# Altium schematic sheet Decawave.SchDoc
size A
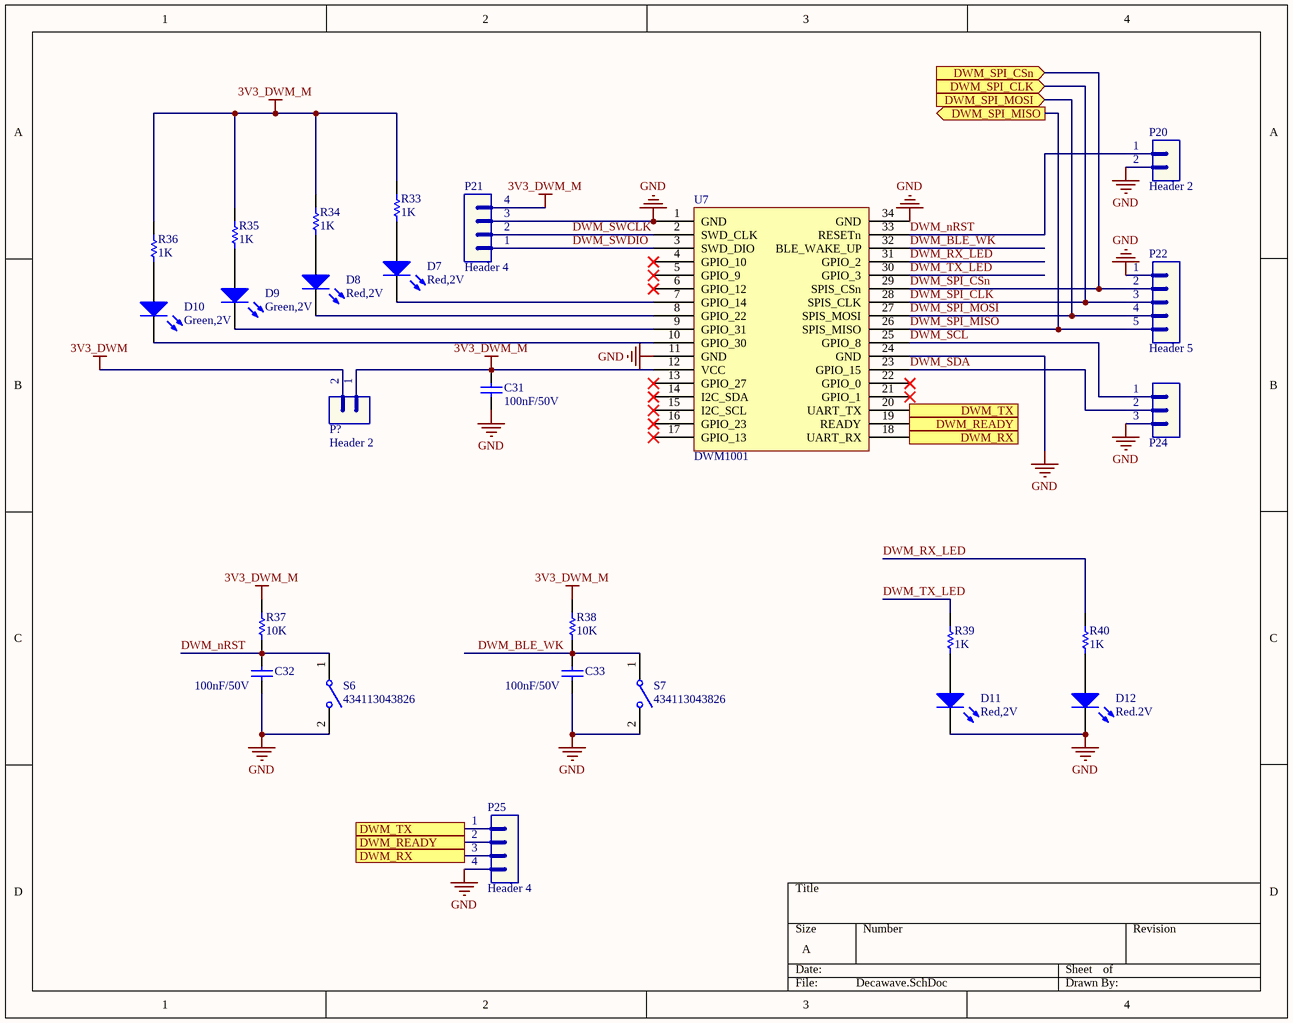
[diagram p0: Decawave.SchDoc]

## Parts
C31  value 100nF/50V  [CAP-SM-0805]  (hidden comment: Cap-100nF-50V-0805)
C32  value 100nF/50V  [CAP-SM-0805]  (hidden comment: Cap-100nF-50V-0805)
C33  value 100nF/50V  [CAP-SM-0805]  (hidden comment: Cap-100nF-50V-0805)
D7  value Red,2V  [LED-3mm]  (hidden comment: LED-RED-TH-3mm)
D8  value Red,2V  [LED-3mm]  (hidden comment: LED-RED-TH-3mm)
D9  value Green,2V  [LED-3mm]  (hidden comment: LED-GREEN-TH-3mm)
D10  value Green,2V  [LED-3mm]  (hidden comment: LED-GREEN-TH-3mm)
D11  value Red,2V  [LED-3mm]  (hidden comment: LED-RED-TH-3mm)
D12  value Red.2V  [LED-3mm]  (hidden comment: LED-RED-TH-3mm)
P20  Header 2  [JP2]
P21  Header 4  [JP4]
P22  Header 5  [JP5]
P24  Header 3  [JP3]  (value not drawn)
P25  Header 4  [JP4]
P?  Header 2  [JP2]
R33  value 1K  [RES-SM-0805]  (hidden comment: Res-1K-0805)
R34  value 1K  [RES-SM-0805]  (hidden comment: Res-1K-0805)
R35  value 1K  [RES-SM-0805]  (hidden comment: Res-1K-0805)
R36  value 1K  [RES-SM-0805]  (hidden comment: Res-1K-0805)
R37  value 10K  [RES-SM-0805]  (hidden comment: Res-10k-0805)
R38  value 10K  [RES-SM-0805]  (hidden comment: Res-10k-0805)
R39  value 1K  [RES-SM-0805]  (hidden comment: Res-1K-0805)
R40  value 1K  [RES-SM-0805]  (hidden comment: Res-1K-0805)
S6  434113043826  [434113043826]
S7  434113043826  [434113043826]
U7  DWM1001

## Ports
DWM_READY (in), DWM_READY (out), DWM_RX (in), DWM_RX (out), DWM_SPI_CLK (in), DWM_SPI_CSn (in), DWM_SPI_MISO (out), DWM_SPI_MOSI (in), DWM_TX (in), DWM_TX (out)

## Nets
3V3_DWM: P?.2
3V3_DWM_M: C31.2 P21.4 P?.1 R33.2 R34.2 R35.2 R36.2 R37.2 R38.2 U7.12(VCC)
GND: C31.1 C32.2 C33.2 D11.2(K) D12.2(K) P20.2 P21.3 P22.1 P24.3 P25.4 S6.2 S7.2 U7.1(GND) U7.11(GND) U7.24(GND) U7.34(GND)
DWM_BLE_WK: C33.1 R38.1 S7.1 U7.32(BLE_WAKE_UP)
DWM_nRST: C32.1 P20.1 R37.1 S6.1 U7.33(RESETn)
DWM_READY: P25.2 U7.19(READY) ; port DWM_READY
DWM_RX: P25.3 U7.18(UART_RX) ; port DWM_RX
DWM_RX_LED: R40.2 U7.31(GPIO_2)
DWM_SCL: P24.1 U7.25(GPIO_8)
DWM_SDA: P24.2 U7.23(GPIO_15)
DWM_SPI_CLK: P22.3 U7.28(SPIS_CLK) ; port DWM_SPI_CLK
DWM_SPI_CSn: P22.2 U7.29(SPIS_CSn) ; port DWM_SPI_CSn
DWM_SPI_MISO: P22.5 U7.26(SPIS_MISO) ; port DWM_SPI_MISO
DWM_SPI_MOSI: P22.4 U7.27(SPIS_MOSI) ; port DWM_SPI_MOSI
DWM_SWCLK: P21.2 U7.2(SWD_CLK)
DWM_SWDIO: P21.1 U7.3(SWD_DIO)
DWM_TX: P25.1 U7.20(UART_TX) ; port DWM_TX
DWM_TX_LED: R39.2 U7.30(GPIO_3)
NetD7_1: D7.1(A) R33.1
NetD7_2: D7.2(K) U7.7(GPIO_14)
NetD8_1: D8.1(A) R34.1
NetD8_2: D8.2(K) U7.8(GPIO_22)
NetD9_1: D9.1(A) R35.1
NetD9_2: D9.2(K) U7.9(GPIO_31)
NetD10_1: D10.1(A) R36.1
NetD10_2: D10.2(K) U7.10(GPIO_30)
NetD11_1: D11.1(A) R39.1
NetD12_1: D12.1(A) R40.1

Not connected (* = marked no-connect by the designer): U7 4(GPIO_10)* 5(GPIO_9)* 6(GPIO_12)* 13(GPIO_27)* 14(I2C_SDA)* 15(I2C_SCL)* 16(GPIO_23)* 17(GPIO_13)* 21(GPIO_1)* 22(GPIO_0)*

## Library data of the parts
C31-C33 = Cap-100nF-50V-0805: CAP CER 0.1UF 50V Y5V 0805; Manufacturer: Samsung Electro-Mechanics; Manufacturer Part Number: CL21F104ZBCNNNC; Local Supplier: thegioiic; Local Supplier Link: https://thegioiic.com/products/tu-100nf-0-1uf-50v-0805; Supplier 1: Digikey; Supplier 1 Part Number: 1276-1007-1-ND; Supplier 1 Link: https://www.digikey.com/product-detail/en/samsung-electro-mechanics/CL21F104ZBCNNNC/1276-1007-1-ND/3889093
D7 D8 D11 D12 = LED-RED-TH-3mm: LED RED CLEAR T-1 T/H; Manufacturer: Kingbright; Manufacturer Part Number: WP710A10SEC/J3; Local Supplier: thegioiic; Local Supplier Link: https://thegioiic.com/products/led-do-3mm-chan-dai; Supplier 1: Digikey; Supplier 1 Link: https://www.digikey.com/product-detail/en/kingbright/WP710A10SEC-J3/754-1589-ND/2769815; Supplier 1 Part Number: 754-1589-ND
D9 D10 = LED-GREEN-TH-3mm: LED GREEN CLEAR T-1 T/H; Manufacturer: Kingbright; Manufacturer Part Number: WP710A10ZGC/G; Local Supplier: thegioiic; Local Supplier Link: https://thegioiic.com/products/led-xanh-la-3mm-chan-dai; Supplier 1: Digikey; Supplier 1 Link: https://www.digikey.com/product-detail/en/kingbright/WP710A10ZGC-G/754-1612-ND/2769684; Supplier 1 Part Number: 754-1612-ND
P20 P? = Header 2: Header, 2-Pin; LatestRevisionDate: 17-Jul-2002; LatestRevisionNote: Re-released for DXP Platform.; Publisher: Altium Limited
P21 P25 = Header 4: Header, 4-Pin; LatestRevisionDate: 17-Jul-2002; LatestRevisionNote: Re-released for DXP Platform.; Publisher: Altium Limited
P22 = Header 5: Header, 5-Pin; LatestRevisionDate: 17-Jul-2002; LatestRevisionNote: Re-released for DXP Platform.; Publisher: Altium Limited
P24 = Header 3: Header, 3-Pin; LatestRevisionDate: 17-Jul-2002; LatestRevisionNote: Re-released for DXP Platform.; Publisher: Altium Limited
R33-R36 R39 R40 = Res-1K-0805: RES 1K OHM 1% 1/4W 0805; Manufacturer: Stackpole Electronics Inc; Manufacturer Part Number: RNCP0805FTD1K00; Local Supplier: thegioiic; Local Supplier Link: https://thegioiic.com/products/dien-tro-1k-ohm-0805-5; Supplier 1: Digikey; Supplier 1 Link: https://www.digikey.com/product-detail/en/stackpole-electronics-inc/RNCP0805FTD1K00/RNCP0805FTD1K00CT-ND/2240568; Supplier 1 Part Number: RNCP0805FTD1K00CT-ND
R37 R38 = Res-10k-0805: RES 10K OHM 1% 1/4W 0805; Manufacturer: Stackpole Electronics Inc; Manufacturer Part Number: RNCP0805FTD10K0; Local Supplier: thegioiic; Local Supplier Link: https://thegioiic.com/products/dien-tro-10k-ohm-0805-5; Supplier 1: Digikey; Supplier 1 Link: https://www.digikey.com/product-detail/en/stackpole-electronics-inc/RNCP0805FTD10K0/RNCP0805FTD10K0CT-ND/2240601; Supplier 1 Part Number: RNCP0805FTD10K0CT-ND
S6 S7 = 434113043826: WS-TASV J-Bend SMT Tact Switch 6x3.5mm, height 4.3mm, 260gf; Rated Voltage: 12VDC; Rated Current: 50mA; Washable: No; ComponentLink1Description: Manufacturer; ComponentLink1URL: http://www.we-online.de; ComponentLink2Description: Datasheet; ComponentLink2URL: https://katalog.we-online.com/em/datasheet/434113043826.pdf; Operating Temperature: -40 to +85degC; Part Number: 434113043826; Published Date: September 2019; Contact Material: Stainless Steel; Height: 4.3mm; Mounting Technology: SMT; Contact Plating: Silver; Operation Force: 260gf; Packaging: Tape and Reel; Terminal Material: Copper Alloy; Publisher: Wurth Elektronik; Terminal Plating: Silver